# EasyEDA schematic SCH_MyFirstCPU_2022-09-18.json

## Sheets
1 Sheet_1: TITLE: MyFirstCPU; REV: 1.0; Date: 2022-09-16; Sheet: 1/2; Drawn By: zhangzrjerry; Company: 改进自书籍《CPU自制入门》
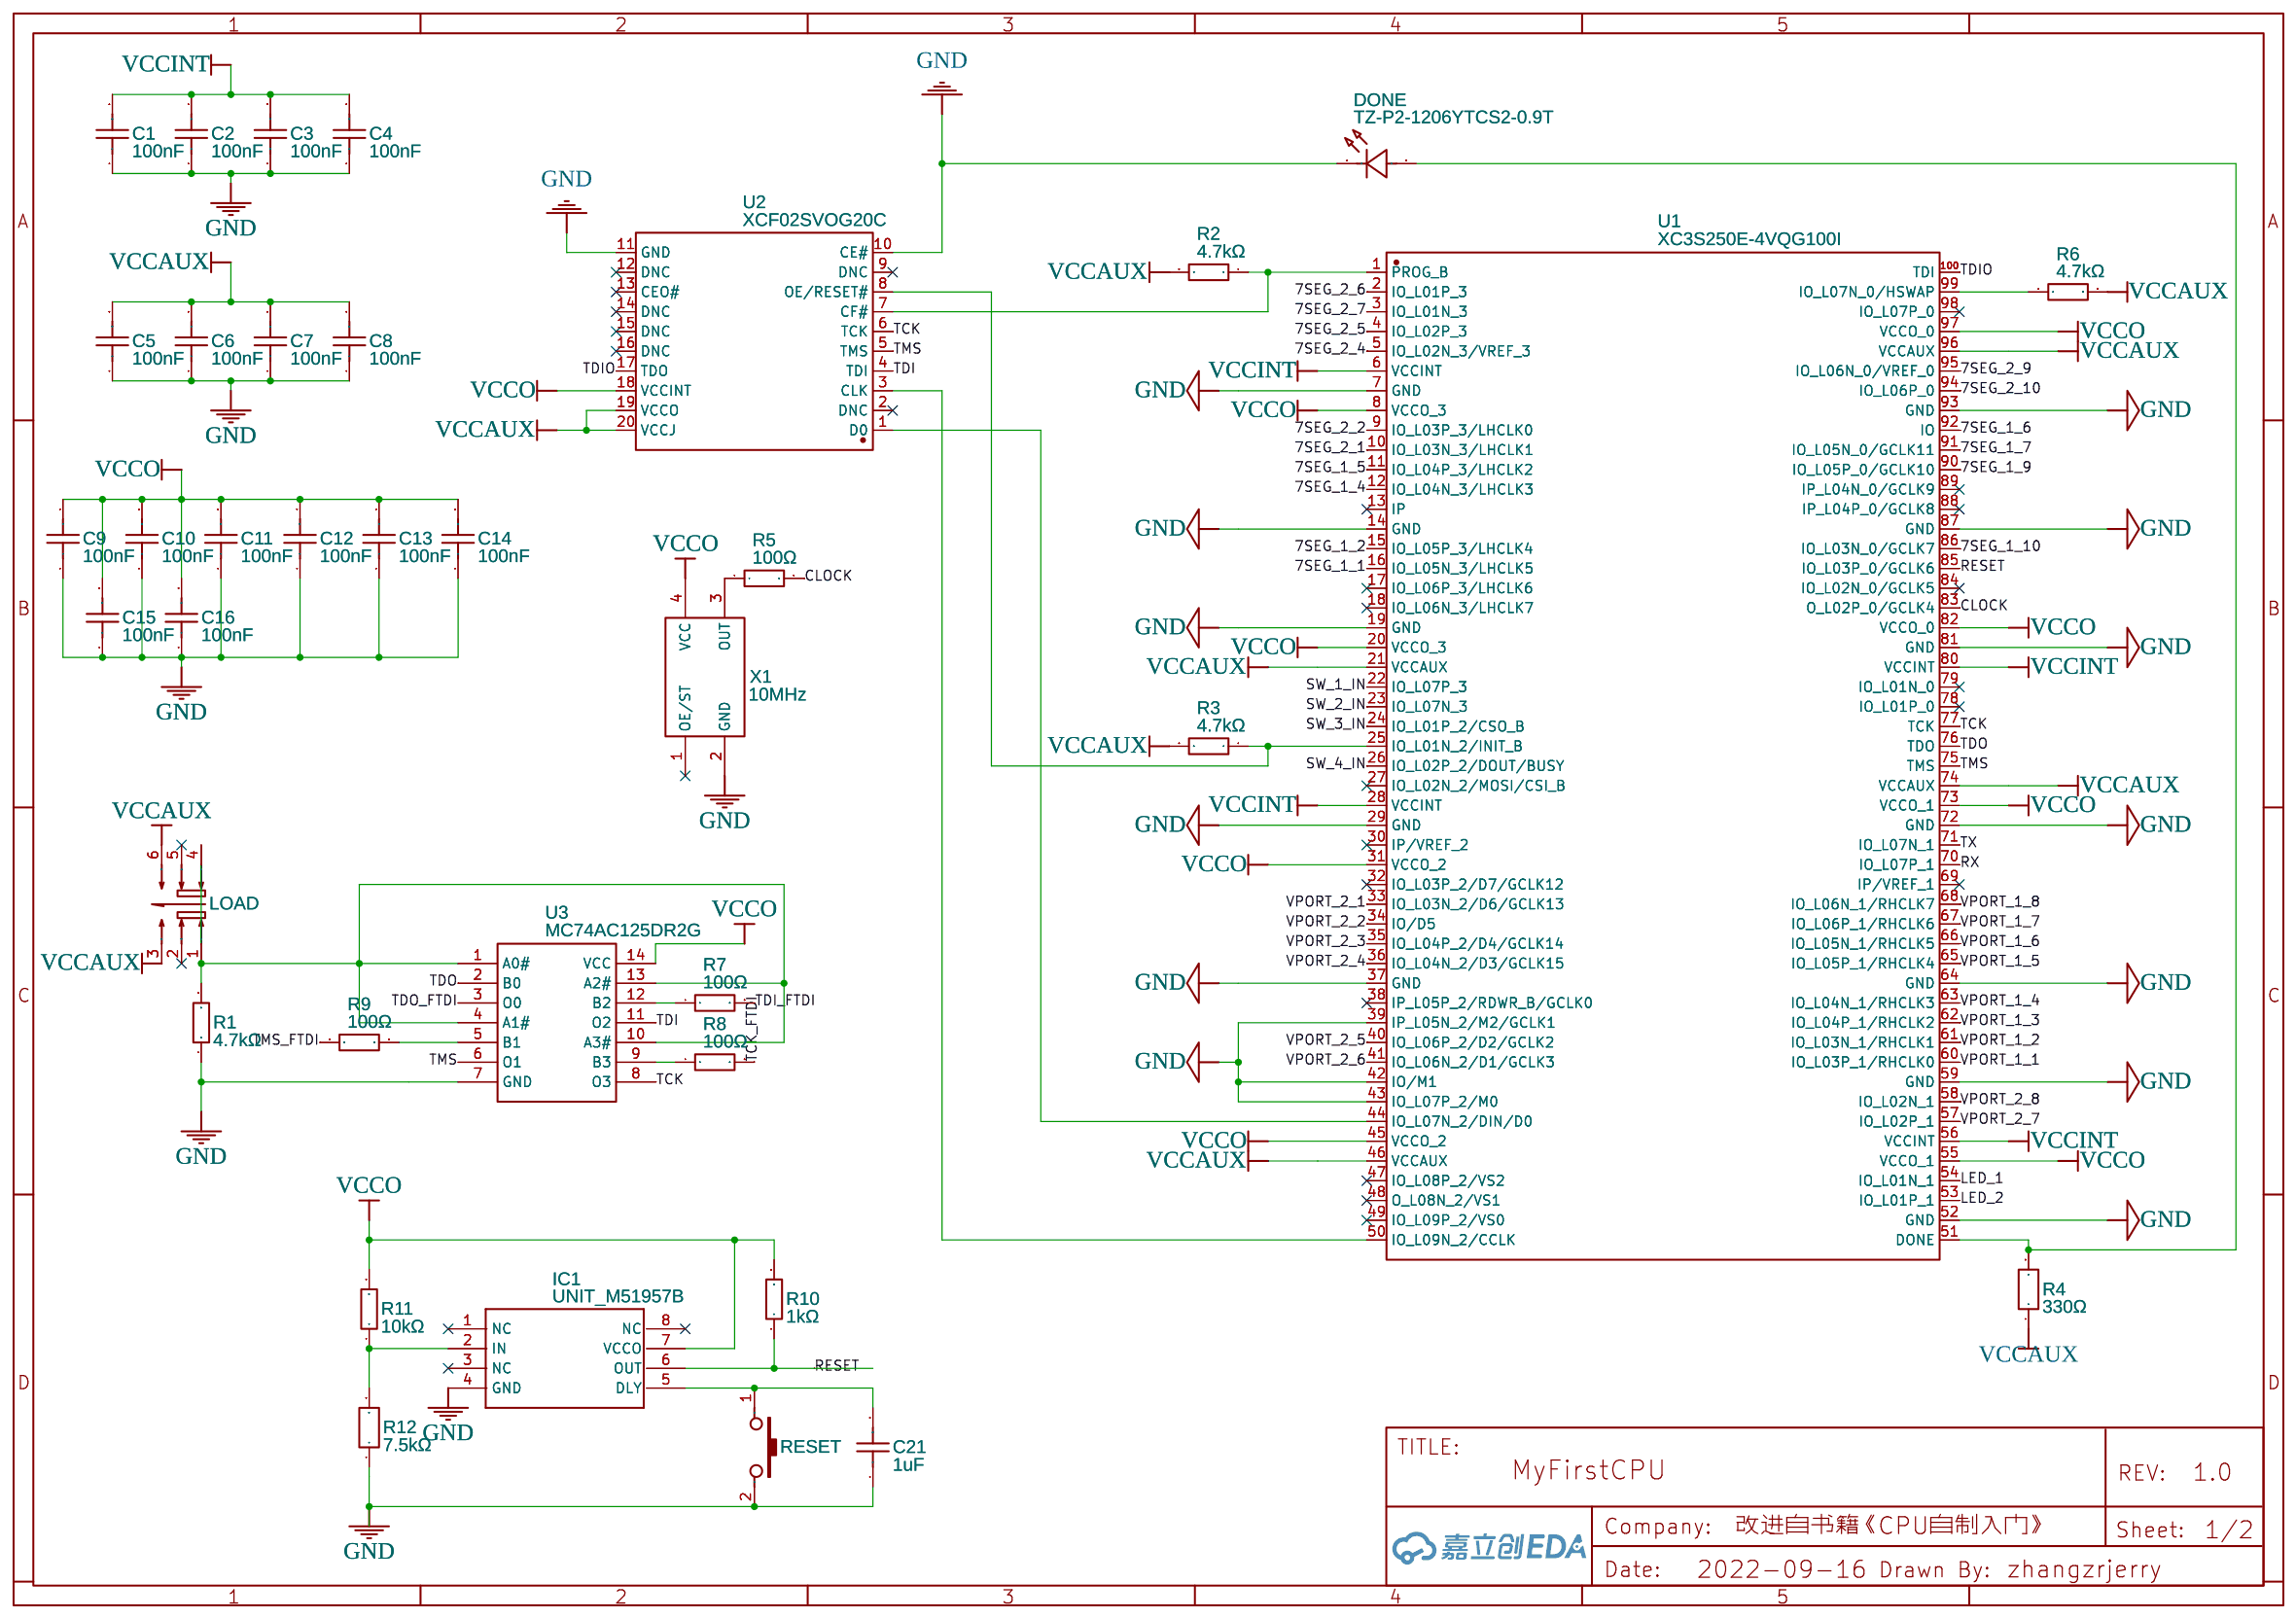
[diagram p0: Sheet_1]
2 Sheet_2: Date: 2022-09-17; Sheet: 2/2
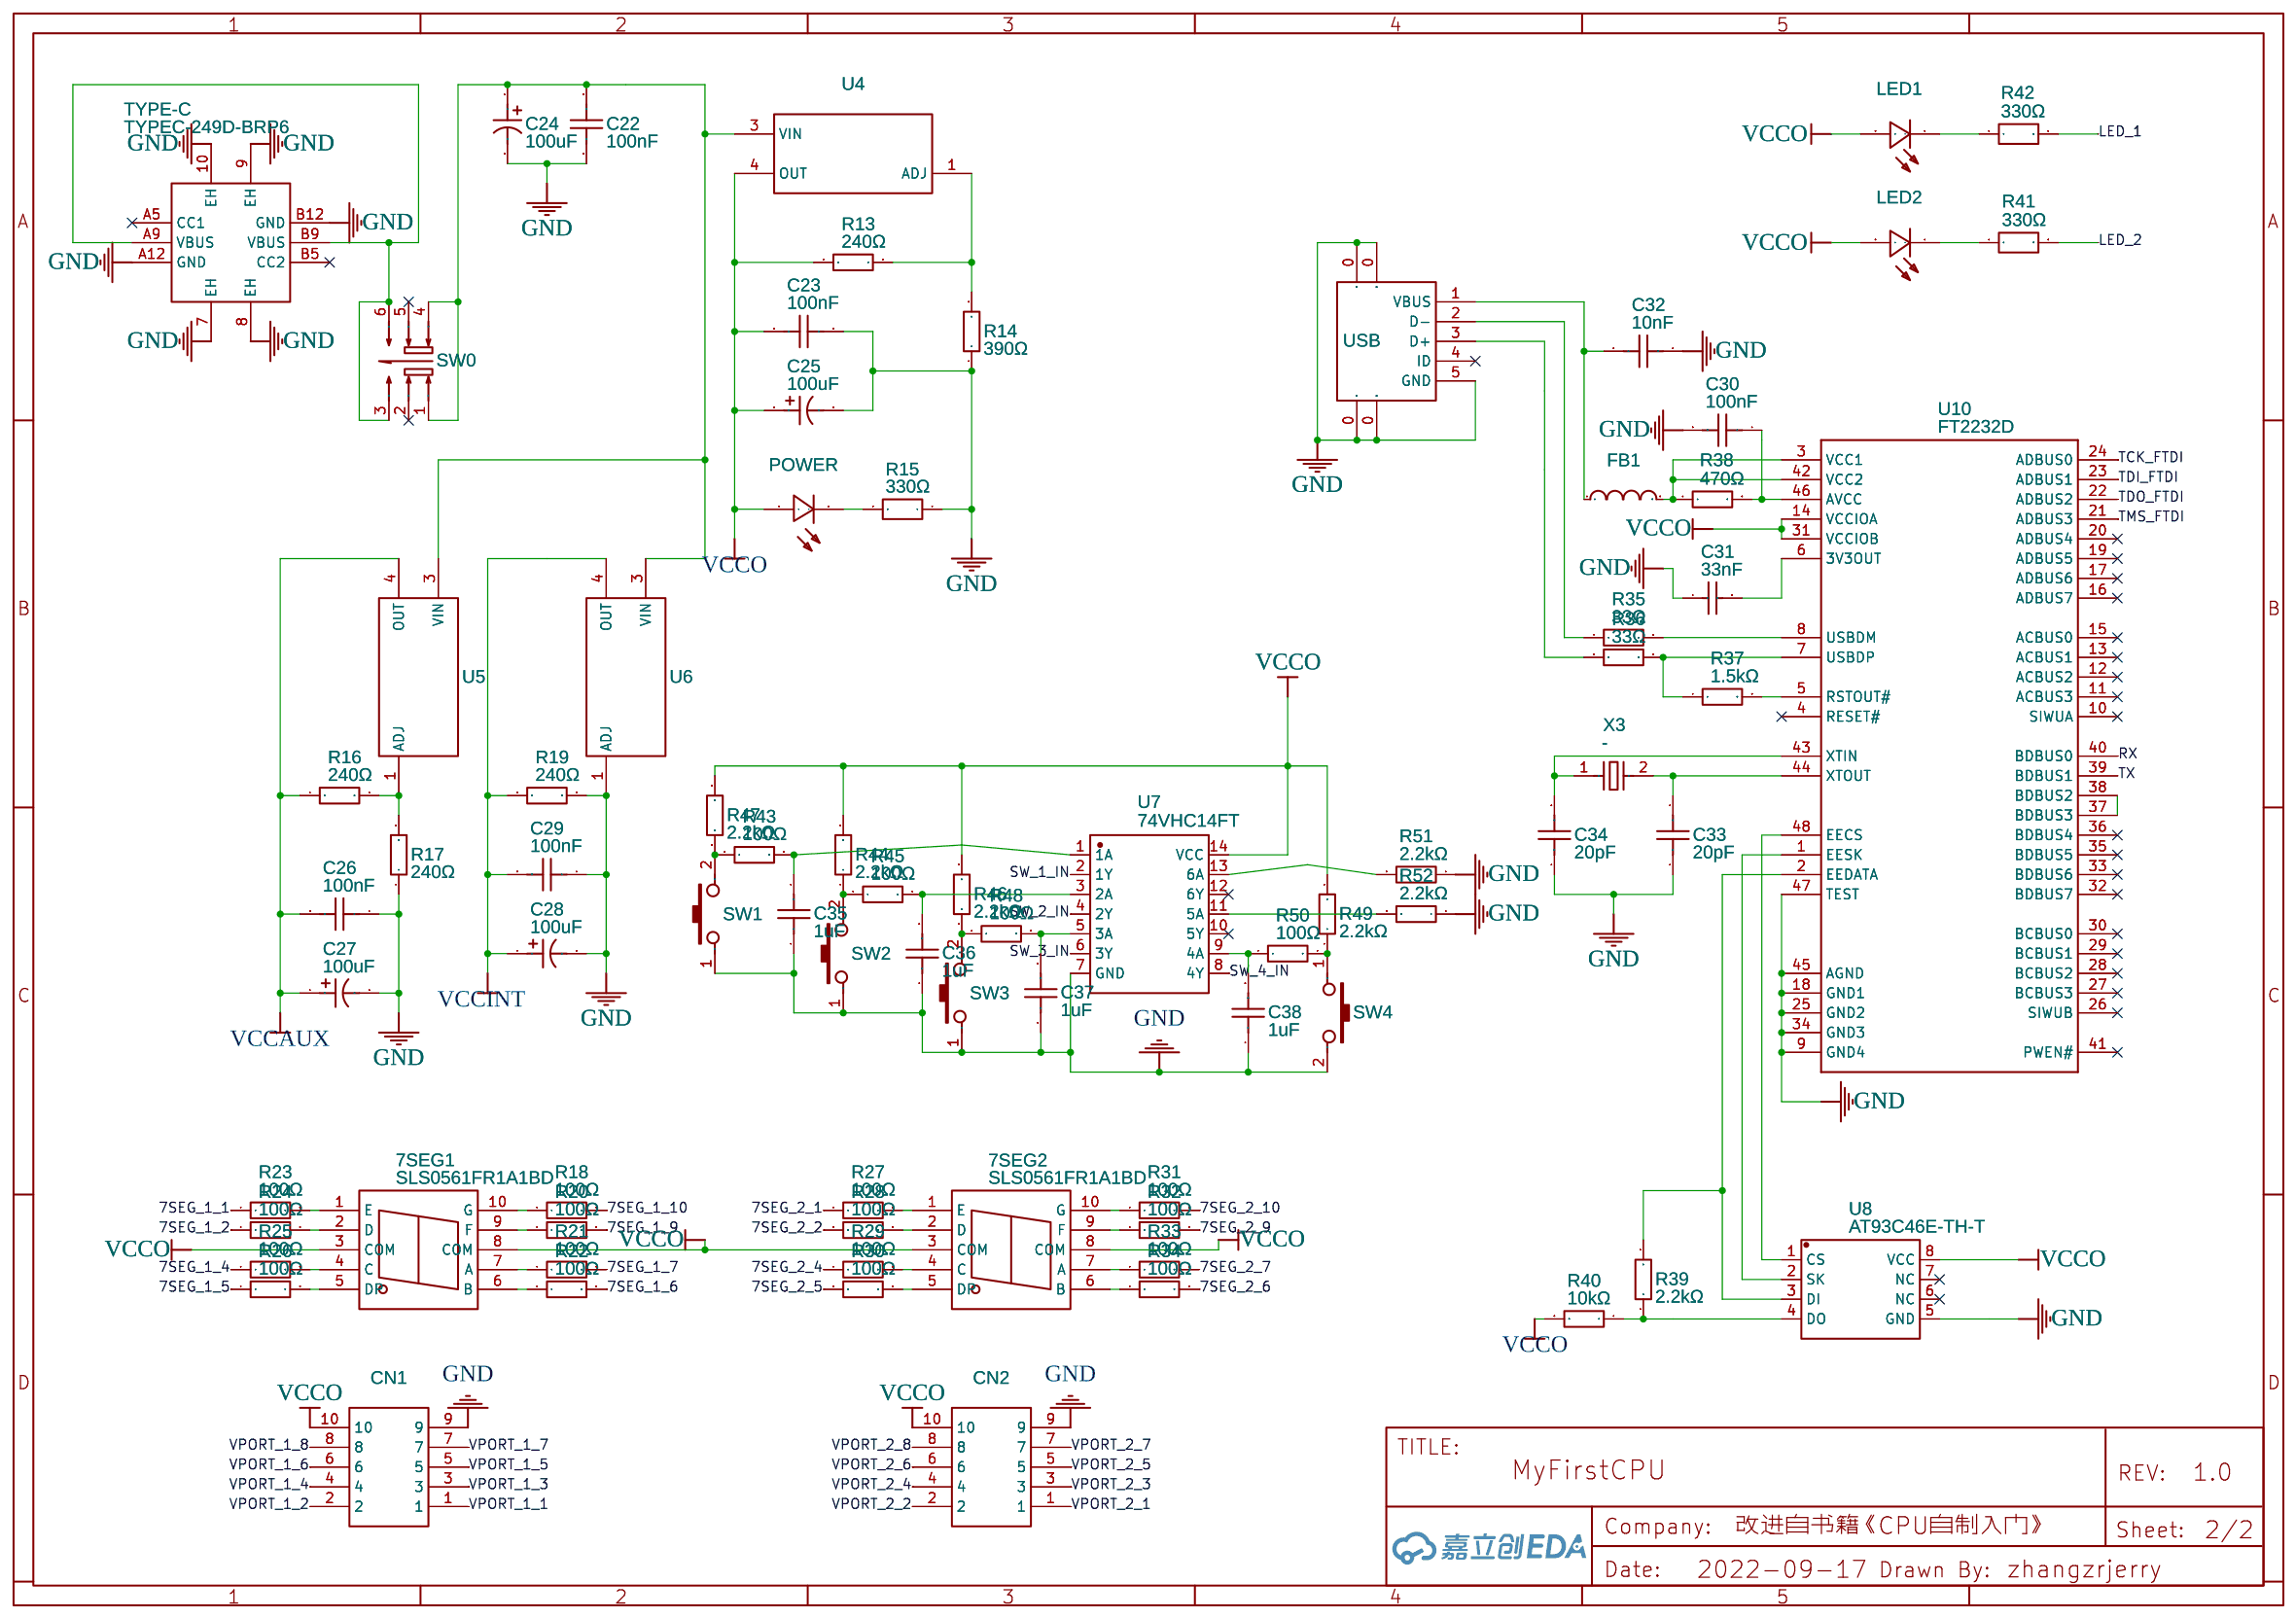
[diagram p1: Sheet_2]

## Parts
sheet Sheet_1
C1  100nF  [C1206]
C2  100nF  [C1206]
C3  100nF  [C1206]
C4  100nF  [C1206]
C5  100nF  [C1206]
C6  100nF  [C1206]
C7  100nF  [C1206]
C8  100nF  [C1206]
C9  100nF  [C1206]
C10  100nF  [C1206]
C11  100nF  [C1206]
C12  100nF  [C1206]
C13  100nF  [C1206]
C14  100nF  [C1206]
C15  100nF  [C1206]
C16  100nF  [C1206]
C21  1uF  [C1206]
DONE  TZ-P2-1206YTCS2-0.9T  [LED1206-RD_YELLOW-1]
IC1  UNIT_M51957B  [SMD_SOP8]
LOAD  XKB5858-Z-TP  [SW-SMD_6P-L5.8-W5.8-P2.00-LS8.3]
R1  4.7kΩ  [R1206]
R2  4.7kΩ  [R1206]
R3  4.7kΩ  [R1206]
R4  330Ω  [R1206]
R5  100Ω  [R1206]
R6  4.7kΩ  [R1206]
R7  100Ω  [R1206]
R8  100Ω  [R1206]
R9  100Ω  [R1206]
R10  1kΩ  [R1206]
R11  10kΩ  [R1206]
R12  7.5kΩ  [R1206]
RESET  TC  [KEY-SMD_L6.0-W3.6-LS8.3-L]
U1  XC3S250E-4VQG100I  [QFP-100_L14.0-W14.0-P0.50-LS16.0-BL]
U2  XCF02SVOG20C  [TSSOP-20_L6.5-W4.4-P0.65-LS6.4-BL]
U3  MC74AC125DR2G  [SOIC-14_L8.7-W3.9-P1.27-LS6.0-BL]
X1  10MHz  [OSC-SMD_4P-L7.0-W5.0-BL_SG7050]
sheet Sheet_2
7SEG1  SLS0561FR1A1BD  [LED-SEG-SMD_SLS0561FR1A1BD]
7SEG2  SLS0561FR1A1BD  [LED-SEG-SMD_SLS0561FR1A1BD]
C22  100nF  [C1206]
C23  100nF  [C1206]
C24  100uF  [CAP-SMD_BD6.3-L6.6-W6.6-LS7.2-FD]
C25  100uF  [CAP-SMD_BD6.3-L6.6-W6.6-LS7.2-FD]
C26  100nF  [C1206]
C27  100uF  [CAP-SMD_BD6.3-L6.6-W6.6-LS7.2-FD]
C28  100uF  [CAP-SMD_BD6.3-L6.6-W6.6-LS7.2-FD]
C29  100nF  [C1206]
C30  100nF  [C1206]
C31  33nF  [C1206]
C32  10nF  [C1206]
C33  20pF  [C1206]
C34  20pF  [C1206]
C35  1uF  [C1206]
C36  1uF  [C1206]
C37  1uF  [C1206]
C38  1uF  [C1206]
CN1  Z-231011810106  [IDC-TH_Z-231011810106]
CN2  Z-231011810106  [IDC-TH_Z-231011810106]
FB1  PZ3216U601-1R5TF  [L1206]
LED1  E6C1206CWAY1UDA  [LED1206-RD_WHITE]
LED2  E6C1206CWAY1UDA  [LED1206-RD_WHITE]
POWER  E6C1206QBAC1UDA  [LED1206-R-RD]
R13  240Ω  [R1206]
R14  390Ω  [R1206]
R15  330Ω  [R1206]
R16  240Ω  [R1206]
R17  240Ω  [R1206]
R18  100Ω  [R1206]
R19  240Ω  [R1206]
R20  100Ω  [R1206]
R21  100Ω  [R1206]
R22  100Ω  [R1206]
R23  100Ω  [R1206]
R24  100Ω  [R1206]
R25  100Ω  [R1206]
R26  100Ω  [R1206]
R27  100Ω  [R1206]
R28  100Ω  [R1206]
R29  100Ω  [R1206]
R30  100Ω  [R1206]
R31  100Ω  [R1206]
R32  100Ω  [R1206]
R33  100Ω  [R1206]
R34  100Ω  [R1206]
R35  33Ω  [R1206]
R36  33Ω  [R1206]
R37  1.5kΩ  [R1206]
R38  470Ω  [R1206]
R39  2.2kΩ  [R1206]
R40  10kΩ  [R1206]
R41  330Ω  [R1206]
R42  330Ω  [R1206]
R43  100Ω  [R1206]
R44  2.2kΩ  [R1206]
R45  100Ω  [R1206]
R46  2.2kΩ  [R1206]
R47  2.2kΩ  [R1206]
R48  100Ω  [R1206]
R49  2.2kΩ  [R1206]
R50  100Ω  [R1206]
R51  2.2kΩ  [R1206]
R52  2.2kΩ  [R1206]
SW0  XKB5858-Z-TP  [SW-SMD_6P-L5.8-W5.8-P2.00-LS8.3]
SW1  TC  [KEY-SMD_L6.0-W3.6-LS8.3-L]
SW2  TC  [KEY-SMD_L6.0-W3.6-LS8.3-L]
SW3  TC  [KEY-SMD_L6.0-W3.6-LS8.3-L]
SW4  TC  [KEY-SMD_L6.0-W3.6-LS8.3-L]
TYPE-C  TYPEC-249D-BRP6  [USB-C-SMD_XUNPU_TYPEC-249D-BRP6]
U4  LM317AG-TN3-R  [TO-252-2_L6.5-W6.1-P4.58-LS10.0-TL]
U5  LM317AG-TN3-R  [TO-252-2_L6.5-W6.1-P4.58-LS10.0-TL]
U6  LM317AG-TN3-R  [TO-252-2_L6.5-W6.1-P4.58-LS10.0-TL]
U7  74VHC14FT  [TSSOP-14_L5.0-W4.4-P0.65-LS6.4-BL]
U8  AT93C46E-TH-T  [TSSOP-8_L4.4-W3.0-P0.65-LS6.4-BL-2]
U10  FT2232D  [LQFP-48_L7.0-W7.0-P0.50-LS9.0-BL]
USB  U254-051N-4BH83-F1B  [MICRO-USB-SMD_U254-051N-4BH83-F1B]
X3  -  [CRYSTAL-SMD_L11.4-W4.8-LS12.7]

## Library data of the parts
C1-C16 C22 C23 C26 C29 C30 = GRM31MR71H104KA01L: Supplier: LCSC; Supplier Part: C469550; Manufacturer: muRata(村田); Contributor: lcsc
C21 = CL31A105KB9LNNC: Supplier: LCSC; Supplier Part: C444884; Manufacturer: Samsung Electro-Mechanics; Contributor: LCSC; JLCPCB Part Class: Extended Part
DONE = TZ-P2-1206YTCS2-0.9T: Supplier: LCSC; Supplier Part: C779811; Manufacturer: TUOZHAN; Contributor: LCSC; JLCPCB Part Class: Extended Part
IC1 = UNIT_M51957B: Contributor: mayx
LOAD SW0 = XKB5858-Z-TP: Supplier: LCSC; Supplier Part: C381090; Manufacturer: XKB Enterprise; Contributor: LCSC; JLCPCB Part Class: Extended Part
R1-R3 R6 = CR-06JL7---4K7: Supplier: LCSC; Supplier Part: C280050; Manufacturer: Viking Tech; Resistance (Ohms): 4.7K; Contributor: LCSC; JLCPCB Part Class: Extended Part
R4 R15 R41 R42 = MCR18EZPJ331: Supplier: LCSC; Supplier Part: C507456; Manufacturer: ROHM Semicon; Contributor: LCSC; JLCPCB Part Class: Extended Part
R5 R7-R9 R18 R20-R34 R43 R45 R48 R50 = RMC12061001%N: Supplier: LCSC; Supplier Part: C325893; Manufacturer: Tyohm; Resistance (Ohms): 100; Contributor: LCSC; JLCPCB Part Class: Extended Part
R10 = RMC12061K5%N: Supplier: LCSC; Supplier Part: C269755; Manufacturer: Tyohm; Resistance (Ohms): 1K; Contributor: LCSC; JLCPCB Part Class: Extended Part
R11 R40 = 1206W4J0103T5E: Supplier: LCSC; Manufacturer: UniOhm; Supplier Part: C1489; Resistance (Ohms): 10K; JLCPCB Part Class: Extended Part
R12 = AS0606J0752T5E: Supplier: LCSC; Supplier Part: C966034; Manufacturer: UNI-ROYAL(Uniroyal Elec); Contributor: LCSC; JLCPCB Part Class: Extended Part
RESET SW1-SW4 = TC-3602-4.3-260GKK: Supplier: LCSC; Supplier Part: C3012022; Manufacturer: HCTL(华灿天禄); link: https://atta.szlcsc.com/upload/public/pdf/source/20220518/6D175C8940F68BF811D78C39BEAD4144.pdf; Contributor: lcsc; JLCPCB Part Class: Extended Part
U1 = XC3S250E-4VQG100I: Supplier: LCSC; Supplier Part: C2684980; Manufacturer: XILINX(赛灵思); Contributor: lcsc; JLCPCB Part Class: Extended Part
U2 = XCF02SVOG20C: Supplier: LCSC; Supplier Part: C569040; Manufacturer: XILINX(赛灵思); JLCPCB Part Class: Extended Part; Contributor: LCSC
U3 = MC74AC125DR2G: Supplier: LCSC; Manufacturer: ON; Supplier Part: C99675; JLCPCB Part Class: Extended Part
X1 = X1G004481000500: Supplier: LCSC; Manufacturer: EPSON; Supplier Part: C16850; JLCPCB Part Class: Extended Part
7SEG1 7SEG2 = SLS0561FR1A1BD: Supplier: LCSC; Supplier Part: C226002; Manufacturer: SUNLIGHT; Contributor: LCSC; JLCPCB Part Class: Extended Part
C24 C25 C27 C28 = RVT100UF16V67RV0016: Supplier: LCSC; Supplier Part: C2887276; Manufacturer: KNSCHA(科尼盛); Contributor: LCSC; JLCPCB Part Class: Extended Part
C31 = GRM3195C1H333JA01D: Supplier: LCSC; Manufacturer: MuRata; Supplier Part: C97930; JLCPCB Part Class: Extended Part
C32 = TCC1206X7R103K501DTS: Supplier: LCSC; Supplier Part: C377058; Manufacturer: CCTC; Contributor: LCSC; JLCPCB Part Class: Extended Part
C33 C34 = CC1206JRNPO9BN200: Supplier: LCSC; Supplier Part: C113883; Manufacturer: YAGEO; Contributor: LCSC; JLCPCB Part Class: Extended Part
C35-C38 = CL31B105KBHNNNE: Supplier: LCSC; Manufacturer: SAMSUNG; Supplier Part: C1848; JLCPCB Part Class: Basic Part
CN1 CN2 = Z-231011810106: Supplier: LCSC; Manufacturer: ZHENGLING; Supplier Part: C93713; JLCPCB Part Class: Extended Part
FB1 = PZ3216U601-1R5TF: Supplier: LCSC; Supplier Part: C370100; Manufacturer: Sunlord; Contributor: LCSC; JLCPCB Part Class: Extended Part
LED1 LED2 = E6C1206CWAY1UDA: Supplier: LCSC; Supplier Part: C375462; Manufacturer: EKINGLUX; Contributor: LCSC; JLCPCB Part Class: Extended Part
POWER = E6C1206QBAC1UDA: Supplier: LCSC; Supplier Part: C375460; Manufacturer: EKINGLUX; Contributor: LCSC; JLCPCB Part Class: Extended Part
R13 R16 R17 R19 = 1206W4F2400T5E: Supplier: LCSC; Manufacturer: UniOhm; Supplier Part: C17961; Resistance (Ohms): 240; JLCPCB Part Class: Extended Part
R14 = 1206W4J0391T5E: Supplier: LCSC; Manufacturer: UniOhm; Supplier Part: C25378; Resistance (Ohms): 390; JLCPCB Part Class: Extended Part
R35 R36 = 1206W4J0330T5E: Supplier: LCSC; Manufacturer: UniOhm; Supplier Part: C25375; Resistance (Ohms): 33; JLCPCB Part Class: Extended Part
R37 = 1206W4F1501T5E: Supplier: LCSC; Manufacturer: UniOhm; Supplier Part: C26030; Resistance (Ohms): 1.5K; JLCPCB Part Class: Extended Part
R38 = RS-06K471JT: Supplier: LCSC; Manufacturer: FH; Resistance (Ohms): 470; Contributor: LCSC; Supplier Part: C118071; JLCPCB Part Class: Extended Part
R39 R44 R46 R47 R49 R51 R52 = 1206W4J0222T5E: Supplier: LCSC; Manufacturer: UniOhm; Supplier Part: C26038; Resistance (Ohms): 2.2K; JLCPCB Part Class: Extended Part
TYPE-C = TYPEC-249D-BRP6: Supplier: LCSC; Supplier Part: C2895023; Manufacturer: XUNPU(讯普); Contributor: LCSC; JLCPCB Part Class: Extended Part
U4-U6 = LM317AG-TN3-R: Supplier: LCSC; Manufacturer: UTC; Supplier Part: C75510; JLCPCB Part Class: Basic Part
U7 = 74VHC14FT: Supplier: LCSC; Supplier Part: C80863; Manufacturer: TOSHIBA; Contributor: LCSC; JLCPCB Part Class: Extended Part
U8 = AT93C46E-TH-T: Supplier: LCSC; Supplier Part: C184789; Manufacturer: Microchip Tech; Contributor: LCSC; JLCPCB Part Class: Extended Part
U10 = FT2232D: Contributor: SparkFun; Supplier: LCSC; Manufacturer: FTDI; Supplier Part: C8938; JLCPCB Part Class: Extended Part
USB = U254-051N-4BH83-F1B: Supplier: LCSC; Supplier Part: C319169; Manufacturer: XKB Enterprise; Contributor: LCSC; JLCPCB Part Class: Extended Part
X3 = TAXM6M2IHDBET2T: Supplier: LCSC; Supplier Part: C696838; Manufacturer: TAE(雅晶鑫); JLCPCB Part Class: Extended Part; Contributor: LCSC

## Nets
GND: C1.1 C2.1 C3.1 C4.1 C5.1 C6.1 C7.1 C8.1 C9.1 C10.1 C11.1 C12.1 C13.1 C14.1 C15.1 C16.1 C21.1 C22.1 C23.1 C24.2 C25.2 C26.1 C27.2 C28.2 C29.1 C30.2 C31.1 C32.1 C33.1 C34.1 C35.1 C36.1 C37.1 C38.1 CN1.9 CN2.9 DONE.1(K) IC1.4(GND) R1.1 R12.1 R14.1 R15.1 R17.1 R19.2 R51.1 R52.1 RESET.2 SW1.1 SW2.1 SW3.1 SW4.2 TYPE-C.7(EH) TYPE-C.8(EH) TYPE-C.9(EH) TYPE-C.10(EH) TYPE-C.A12(GND) TYPE-C.B12(GND) U1.7(GND) U1.14(GND) U1.19(GND) U1.29(GND) U1.37(GND) U1.39(IP_L05N_2/M2/GCLK1) U1.42(IO/M1) U1.43(IO_L07P_2/M0) U1.52(GND) U1.59(GND) U1.64(GND) U1.72(GND) U1.81(GND) U1.87(GND) U1.93(GND) U2.10(CE#) U2.11(GND) U3.7(GND) U6.1(ADJ) U7.7(GND) U8.5(GND) U10.9(GND4) U10.18(GND1) U10.25(GND2) U10.34(GND3) U10.45(AGND) U10.47(TEST) USB.0 USB.5(GND) X1.2(GND)
VCCAUX: C5.2 C6.2 C7.2 C8.2 C26.2 C27.1 LOAD.3 LOAD.6 R2.2 R3.2 R4.1 R6.2 R16.1 U1.21(VCCAUX) U1.46(VCCAUX) U1.74(VCCAUX) U1.96(VCCAUX) U2.19(VCCO) U2.20(VCCJ) U5.4(OUT)
VCCINT: C1.2 C2.2 C3.2 C4.2 C28.1 C29.2 R19.1 U1.6(VCCINT) U1.28(VCCINT) U1.56(VCCINT) U1.80(VCCINT) U6.4(OUT)
VCCO: 7SEG1.3(COM) 7SEG1.8(COM) 7SEG2.3(COM) 7SEG2.8(COM) C9.2 C10.2 C11.2 C12.2 C13.2 C14.2 C15.2 C16.2 C23.2 C25.1 CN1.10 CN2.10 IC1.7(VCCO) LED1.2(+) LED2.2(+) POWER.1(+) R10.2 R11.2 R13.1 R40.2 R44.2 R46.2 R47.2 R49.2 U1.8(VCCO_3) U1.20(VCCO_3) U1.31(VCCO_2) U1.45(VCCO_2) U1.55(VCCO_1) U1.73(VCCO_1) U1.82(VCCO_0) U1.97(VCCO_0) U2.18(VCCINT) U3.14(VCC) U4.4(OUT) U7.14(VCC) U8.8(VCC) U10.14(VCCIOA) U10.31(VCCIOB) X1.4(VCC)
7SEG_1_1: R23.1 U1.16(IO_L05N_3/LHCLK5)
7SEG_1_2: R24.1 U1.15(IO_L05P_3/LHCLK4)
7SEG_1_4: R25.1 U1.12(IO_L04N_3/LHCLK3)
7SEG_1_5: R26.1 U1.11(IO_L04P_3/LHCLK2)
7SEG_1_6: R22.2 U1.92(IO)
7SEG_1_7: R21.2 U1.91(IO_L05N_0/GCLK11)
7SEG_1_9: R20.2 U1.90(IO_L05P_0/GCLK10)
7SEG_1_10: R18.2 U1.86(IO_L03N_0/GCLK7)
7SEG_2_1: R27.1 U1.10(IO_L03N_3/LHCLK1)
7SEG_2_2: R28.1 U1.9(IO_L03P_3/LHCLK0)
7SEG_2_4: R29.1 U1.5(IO_L02N_3/VREF_3)
7SEG_2_5: R30.1 U1.4(IO_L02P_3)
7SEG_2_6: R34.2 U1.2(IO_L01P_3)
7SEG_2_7: R33.2 U1.3(IO_L01N)
7SEG_2_9: R32.2 U1.95(IO_L06N_0/VREF_0)
7SEG_2_10: R31.2 U1.94(IO_L06P_0)
CLOCK: R5.2 U1.83(O_L02P_0/GCLK4)
LED_1: R42.2 U1.54(IO_L01N_1)
LED_2: R41.2 U1.53(IO_L01P_1)
RESET: IC1.6(OUT) R10.1 U1.85(IO_L03P_0/GCLK6)
RX: U1.70(IO_L07P_1) U10.40(BDBUS0)
SW_1_IN: U1.22(IO_L07P_3) U7.2(1Y)
SW_2_IN: U1.23(IO_L07N_3) U7.4(2Y)
SW_3_IN: U1.24(IO_L01P_2/CSO_B) U7.6(3Y)
SW_4_IN: U1.26(IO_L02P_2/DOUT/BUSY) U7.8(4Y)
TCK: U1.77(TCK) U2.6(TCK) U3.8(O3)
TCK_FTDI: R8.2 U10.24(ADBUS0)
TDI: U2.4(TDI) U3.11(O2)
TDI_FTDI: R7.2 U10.23(ADBUS1)
TDIO: U1.100(TDI) U2.17(TDO)
TDO: U1.76(TDO) U3.2(B0)
TDO_FTDI: U3.3(O0) U10.22(ADBUS2)
TMS: U1.75(TMS) U2.5(TMS) U3.6(O1)
TMS_FTDI: R9.1 U10.21(ADBUS3)
TX: U1.71(IO_L07N_1) U10.39(BDBUS1)
VPORT_1_1: CN1.1 U1.60(IO_L03P_1/RHCLK0)
VPORT_1_2: CN1.2 U1.61(IO_L03N_1/RHCLK1)
VPORT_1_3: CN1.3 U1.62(IO_L04P_1/RHCLK2)
VPORT_1_4: CN1.4 U1.63(IO_L04N_1/RHCLK3)
VPORT_1_5: CN1.5 U1.65(IO_L05P_1/RHCLK4)
VPORT_1_6: CN1.6 U1.66(IO_L05N_1/RHCLK5)
VPORT_1_7: CN1.7 U1.67(IO_L06P_1/RHCLK6)
VPORT_1_8: CN1.8 U1.68(IO_L06N_1/RHCLK7)
VPORT_2_1: CN2.1 U1.33(IO_L03N_2/D6/GCLK13)
VPORT_2_2: CN2.2 U1.34(IO/D5)
VPORT_2_3: CN2.3 U1.35(IO_L04P_2/D4/GCLK14)
VPORT_2_4: CN2.4 U1.36(IO_L04N_2/D3/GCLK15)
VPORT_2_5: CN2.5 U1.40(IO_L06P_2/D2/GCLK2)
VPORT_2_6: CN2.6 U1.41(IO_L06N_2/D1/GCLK3)
VPORT_2_7: CN2.7 U1.57(IO_L02P_1)
VPORT_2_8: CN2.8 U1.58(IO_L02N_1)
Net-(7SEG1-1): 7SEG1.1(E) R23.2
Net-(7SEG1-2): 7SEG1.2(D) R24.2
Net-(7SEG1-4): 7SEG1.4(C) R25.2
Net-(7SEG1-5): 7SEG1.5(DP) R26.2
Net-(7SEG1-6): 7SEG1.6(B) R22.1
Net-(7SEG1-7): 7SEG1.7(A) R21.1
Net-(7SEG1-9): 7SEG1.9(F) R20.1
Net-(7SEG1-10): 7SEG1.10(G) R18.1
Net-(7SEG2-1): 7SEG2.1(E) R27.2
Net-(7SEG2-2): 7SEG2.2(D) R28.2
Net-(7SEG2-4): 7SEG2.4(C) R29.2
Net-(7SEG2-5): 7SEG2.5(DP) R30.2
Net-(7SEG2-6): 7SEG2.6(B) R34.1
Net-(7SEG2-7): 7SEG2.7(A) R33.1
Net-(7SEG2-9): 7SEG2.9(F) R32.1
Net-(7SEG2-10): 7SEG2.10(G) R31.1
Net-(C21-2): C21.2 IC1.5(DLY) RESET.1
Net-(C22-2): C22.2 C24.1 SW0.1 SW0.4 U4.3(VIN) U5.3(VIN) U6.3(VIN)
Net-(C30-1): C30.1 R38.2 U10.46(AVCC)
Net-(C31-2): C31.2 U10.6(3V3OUT)
Net-(C32-2): C32.2 FB1.1 USB.1(VBUS)
Net-(C33-2): C33.2 U10.44(XTOUT) X3.2
Net-(C34-2): C34.2 U10.43(XTIN) X3.1
Net-(C35-2): C35.2 R43.2 U7.1(1A)
Net-(C36-2): C36.2 R45.2 U7.3(2A)
Net-(C37-2): C37.2 R48.2 U7.5(3A)
Net-(C38-2): C38.2 R50.1 U7.9(4A)
Net-(DONE-2): DONE.2(A) R4.2 U1.51(DONE)
Net-(FB1-2): FB1.2 R38.1 U10.3(VCC1) U10.42(VCC2)
Net-(IC1-2): IC1.2(IN) R11.1 R12.2
Net-(LED1-1): LED1.1(-) R42.1
Net-(LED2-1): LED2.1(-) R41.1
Net-(LOAD-1): LOAD.1 LOAD.4 R1.2 U3.1(A0#) U3.4(A1#) U3.10(A3#) U3.13(A2#)
Net-(POWER-2): POWER.2(-) R15.2
Net-(R2-1): R2.1 U1.1(PROG_B) U2.7(CF#)
Net-(R3-1): R3.1 U1.25(IO_L01N_2/INIT_B) U2.8(OE/RESET#)
Net-(R5-1): R5.1 X1.3(OUT)
Net-(R6-1): R6.1 U1.99(IO_L07N_0/HSWAP)
Net-(R7-1): R7.1 U3.12(B2)
Net-(R8-1): R8.1 U3.9(B3)
Net-(R9-2): R9.2 U3.5(B1)
Net-(R13-2): R13.2 R14.2 U4.1(ADJ)
Net-(R16-2): R16.2 R17.2 U5.1(ADJ)
Net-(R35-1): R35.1 USB.2(D-)
Net-(R35-2): R35.2 U10.8(USBDM)
Net-(R36-1): R36.1 USB.3(D+)
Net-(R36-2): R36.2 R37.1 U10.7(USBDP)
Net-(R37-2): R37.2 U10.5(RSTOUT#)
Net-(R39-1): R39.1 R40.1 U8.4(DO)
Net-(R39-2): R39.2 U8.3(DI) U10.2(EEDATA)
Net-(R43-1): R43.1 R47.1 SW1.2
Net-(R44-1): R44.1 R45.1 SW2.2
Net-(R46-1): R46.1 R48.1 SW3.2
Net-(R49-1): R49.1 R50.2 SW4.1
Net-(R51-2): R51.2 U7.13(6A)
Net-(R52-2): R52.2 U7.11(5A)
Net-(SW0-3): SW0.3 SW0.6 TYPE-C.A9(VBUS) TYPE-C.B9(VBUS)
Net-(U1-44): U1.44(IO_L07N_2/DIN/D0) U2.1(D0)
Net-(U1-50): U1.50(IO_L09N_2/CCLK) U2.3(CLK)
Net-(U8-1): U8.1(CS) U10.48(EECS)
Net-(U8-2): U8.2(SK) U10.1(EESK)
Net-(U10-37): U10.37(BDBUS3) U10.38(BDBUS2)

Not connected (* = marked no-connect by the designer): IC1 1(NC)* 3(NC)* 8(NC)*; LOAD 2* 5*; SW0 2* 5*; TYPE-C A5(CC1)* B5(CC2)*; U1 13(IP)* 17(IO_L06P_3/LHCLK6)* 18(IO_L06N_3/LHCLK7)* 27(IO_L02N_2/MOSI/CSI_B)* 30(IP/VREF_2)* 32(IO_L03P_2/D7/GCLK12)* 38(IP_L05P_2/RDWR_B/GCLK0)* 47(IO_L08P_2/VS2)* 48(O_L08N_2/VS1)* 49(IO_L09P_2/VS0)* 69(IP/VREF_1)* 78(IO_L01P_0)* 79(IO_L01N_0)* 84(IO_L02N_0/GCLK5)* 88(IP_L04P_0/GCLK8)* 89(IP_L04N_0/GCLK9)* 98(IO_L07P_0)*; U2 2(DNC)* 9(DNC)* 12(DNC)* 13(CEO#)* 14(DNC)* 15(DNC)* 16(DNC)*; U7 10(5Y)* 12(6Y)*; U8 6(NC)* 7(NC)*; U10 4(RESET#)* 10(SIWUA)* 11(ACBUS3)* 12(ACBUS2)* 13(ACBUS1)* 15(ACBUS0)* 16(ADBUS7)* 17(ADBUS6)* 19(ADBUS5)* 20(ADBUS4)* 26(SIWUB)* 27(BCBUS3)* 28(BCBUS2)* 29(BCBUS1)* 30(BCBUS0)* 32(BDBUS7)* 33(BDBUS6)* 35(BDBUS5)* 36(BDBUS4)* 41(PWEN#)*; USB 4(ID)*; X1 1(OE/ST)*
